# Altium schematic sheet PWM_CON_Sensors.SchDoc: PWM Motor Controller - Sensors
size A4; Author: T. Burns; Revision: 3; SheetNumber: 4; SheetTotal: 5; DrawnBy: Thomas Burns; Organization: N/A; ProjectName: PWM Motor Controller
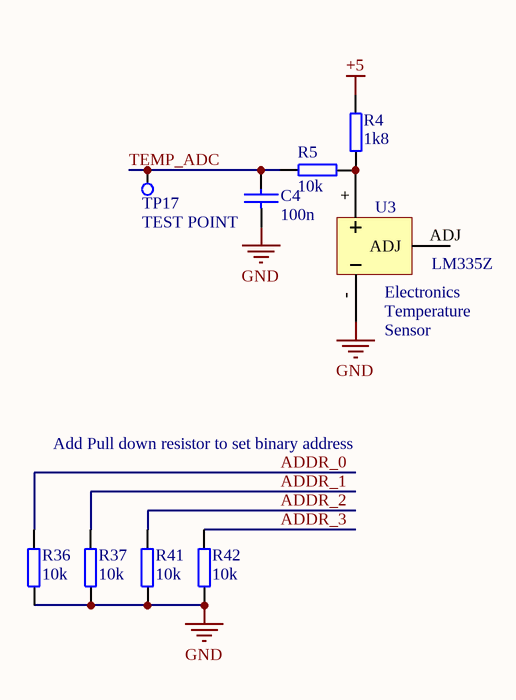
[diagram p0: PWM_CON_Sensors.SchDoc]

## Parts
C4  100n  [0603]
R4  1k8  [0603]
R5  10k  [0603]
R36  10k  [0603]
R37  10k  [0603]
R41  10k  [0603]
R42  10k  [0603]
TP17  TEST POINT  [TEST POINT]
U3  LM335Z  [TO-92_LM335]

## Nets
+5: R4.1
GND: C4.1 R36.1 R37.1 R41.1 R42.1 U3.-
ADDR_0: R36.2
ADDR_1: R37.2
ADDR_2: R41.2
ADDR_3: R42.2
TEMP_ADC: C4.2 R5.2 TP17.1
NetR4_2: R4.2 R5.1 U3.+

Not connected (* = marked no-connect by the designer): U3 ADJ

## Notes on the sheet
- (near U3) Electronics
- (near U3) Temperature
- (near U3) Sensor
- Add Pull down resistor to set binary address
- Title
- Size:
- Date:
- A4
- Number:
- Time:
- Revision:
- Sheet
- of
- File:

## Library data of the parts
C4 = CAP: PartNo: R8835; Supplier: Altronics
R4 = RES8: 1% Resistor; PartNo: R1614; Supplier: Altronics
R5 R36 R37 R41 R42 = RES8: 1% Resistor; PartNo: R1668; Supplier: Altronics
TP17 = TEST POINT: Probe compatible test point
U3 = LM335Z: PartNo: Z2530; Supplier: Altronics